# Altium schematic sheet SCH2_Switching.SchDoc
size B; Organization: CWRUbotix; Address1: 10900 Euclid Avenue; Address2: Cleveland, OH 44106; Address3: USA
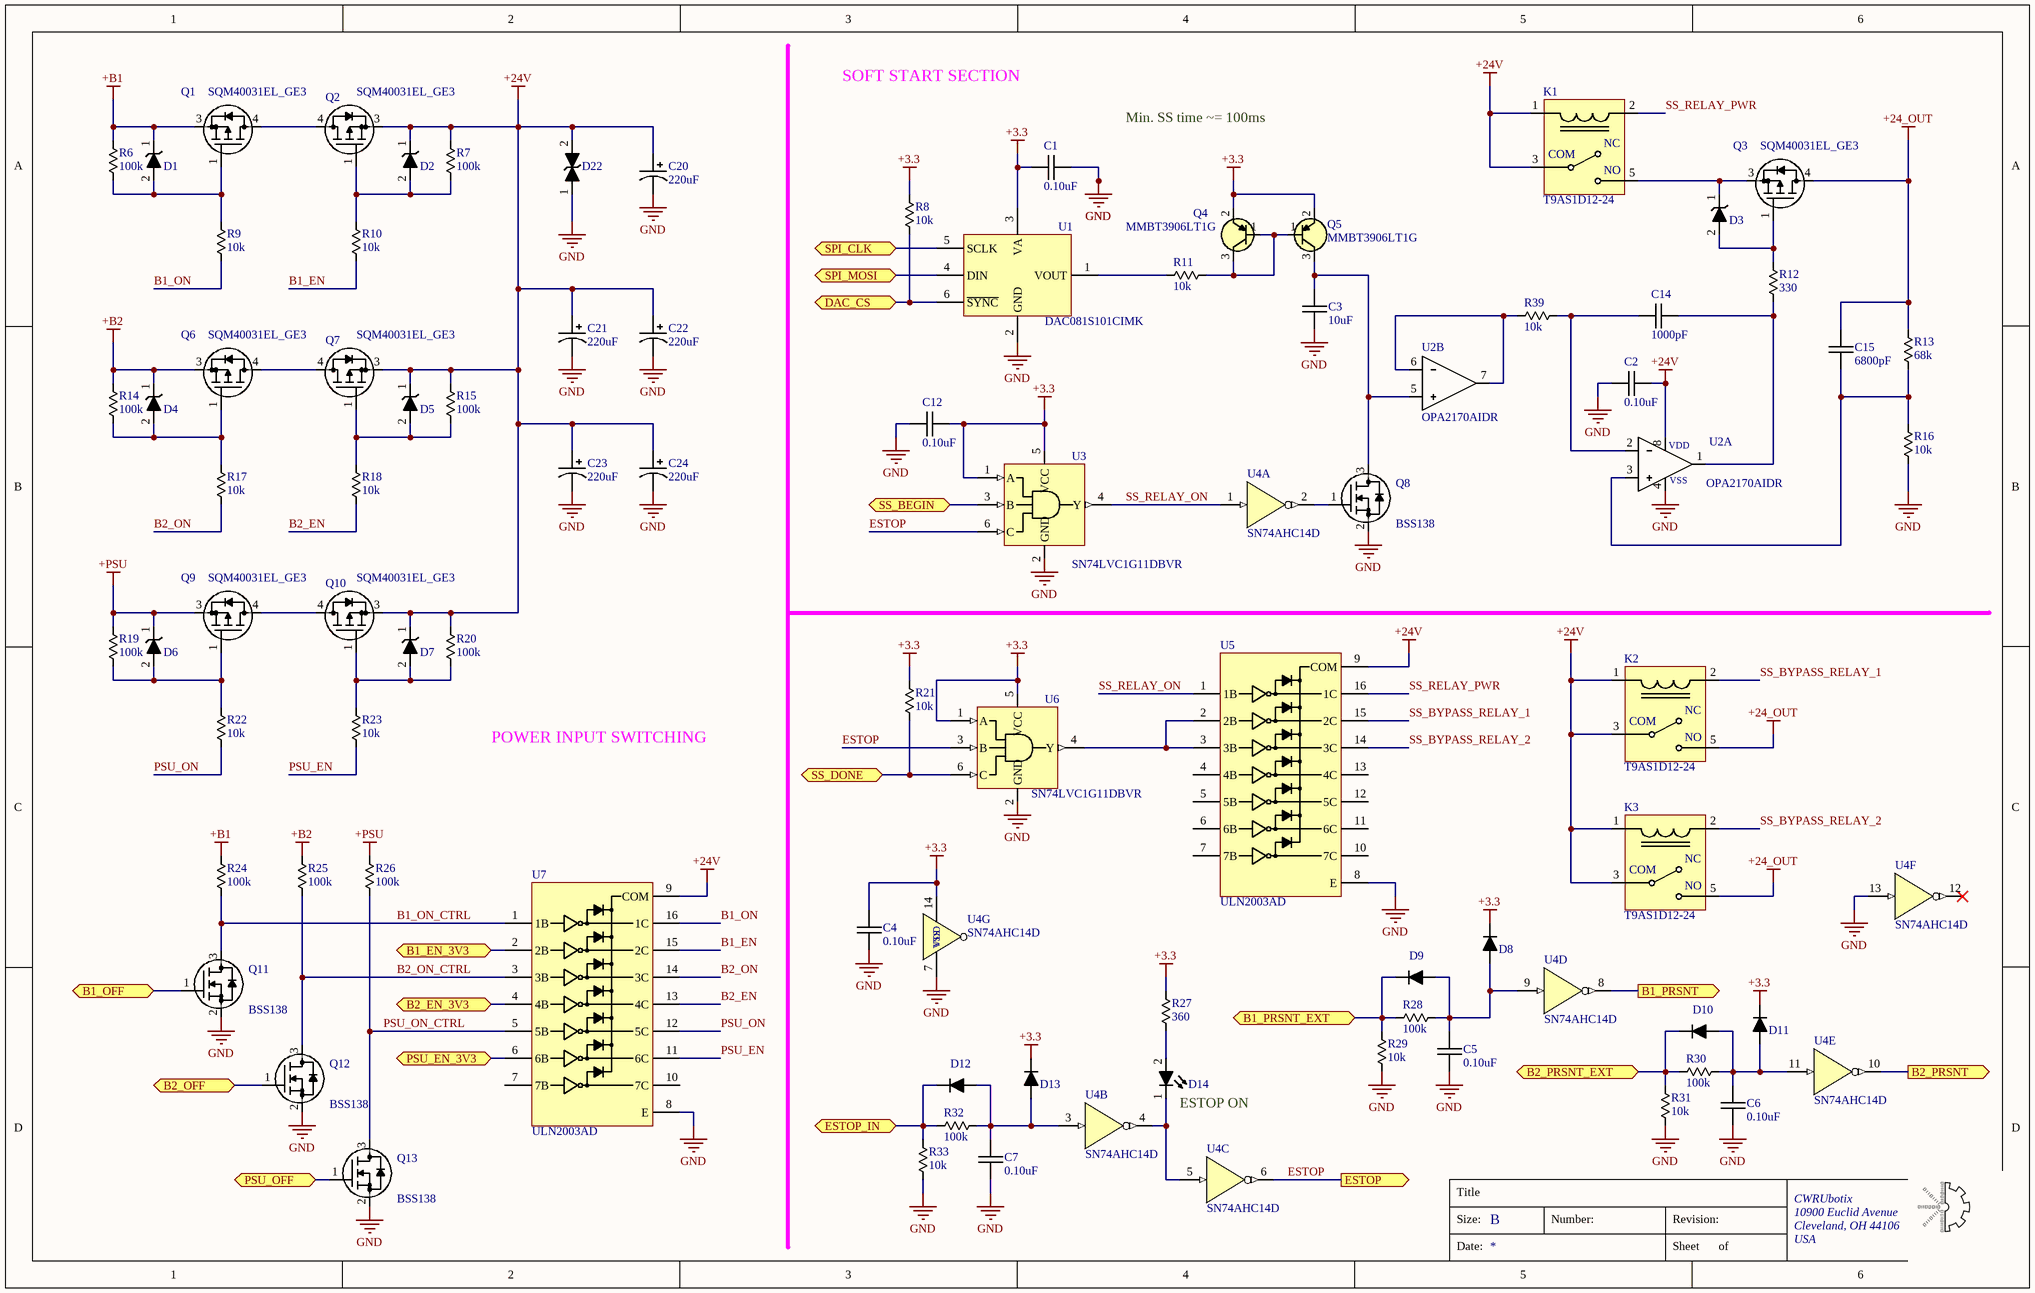
[diagram p0: SCH2_Switching.SchDoc]

## Parts
C1  0.10uF  [chip_0805]
C2  0.10uF  [chip_0805]
C3  10uF  [chip_1206]
C4  0.10uF  [chip_0805]
C5  0.10uF  [chip_0805]
C6  0.10uF  [chip_0805]
C7  0.10uF  [chip_0805]
C12  0.10uF  [chip_0805]
C14  1000pF  [chip_0805]
C15  6800pF  [chip_0805]
C20  220uF  [CP_RADIAL_D10.0_P5.0_H20.0]
C21  220uF  [CP_RADIAL_D10.0_P5.0_H20.0]
C22  220uF  [CP_RADIAL_D10.0_P5.0_H20.0]
C23  220uF  [CP_RADIAL_D10.0_P5.0_H20.0]
C24  220uF  [CP_RADIAL_D10.0_P5.0_H20.0]
D1  diode_1  [sod123_0]  (value not drawn)
D2  diode_1  [sod123_0]  (value not drawn)
D3  diode_1  [sod123_0]  (value not drawn)
D4  diode_1  [sod123_0]  (value not drawn)
D5  diode_1  [sod123_0]  (value not drawn)
D6  diode_1  [sod123_0]  (value not drawn)
D7  diode_1  [sod123_0]  (value not drawn)
D8  diode_0  [sod123_0]  (value not drawn)
D9  diode_0  [sod123_0]  (value not drawn)
D10  diode_0  [sod123_0]  (value not drawn)
D11  diode_0  [sod123_0]  (value not drawn)
D12  diode_0  [sod123_0]  (value not drawn)
D13  diode_0  [sod123_0]  (value not drawn)
D14  diode_4  [chip_0603_LED]  (value not drawn)
D22  diode_5  [do-214ab]  (value not drawn)
K1  T9AS1D12-24  [TE_CONN_T9AS]
K2  T9AS1D12-24  [TE_CONN_T9AS]
K3  T9AS1D12-24  [TE_CONN_T9AS]
Q1  SQM40031EL_GE3  [D2PAK-3_1]
Q2  SQM40031EL_GE3  [D2PAK-3_1]
Q3  SQM40031EL_GE3  [D2PAK-3_1]
Q4  MMBT3906LT1G  [SOT-23-3_1]
Q5  MMBT3906LT1G  [SOT-23-3_1]
Q6  SQM40031EL_GE3  [D2PAK-3_1]
Q7  SQM40031EL_GE3  [D2PAK-3_1]
Q8  BSS138  [sot-23-3]
Q9  SQM40031EL_GE3  [D2PAK-3_1]
Q10  SQM40031EL_GE3  [D2PAK-3_1]
Q11  BSS138  [sot-23-3]
Q12  BSS138  [sot-23-3]
Q13  BSS138  [sot-23-3]
R6  100k  [chip_0805]
R7  100k  [chip_0805]
R8  10k  [chip_0805]
R9  10k  [chip_0805]
R10  10k  [chip_0805]
R11  10k  [chip_0805]
R12  330  [chip_0805]
R13  68k  [chip_0805]
R14  100k  [chip_0805]
R15  100k  [chip_0805]
R16  10k  [chip_0805]
R17  10k  [chip_0805]
R18  10k  [chip_0805]
R19  100k  [chip_0805]
R20  100k  [chip_0805]
R21  10k  [chip_0805]
R22  10k  [chip_0805]
R23  10k  [chip_0805]
R24  100k  [chip_0805]
R25  100k  [chip_0805]
R26  100k  [chip_0805]
R27  360  [chip_0805]
R28  100k  [chip_0805]
R29  10k  [chip_0805]
R30  100k  [chip_0805]
R31  10k  [chip_0805]
R32  100k  [chip_0805]
R33  10k  [chip_0805]
R39  10k  [chip_0805]
U1  DAC081S101CIMK  [TSOT-23-6]
U2  OPA2170AIDR  [SO-8_1]  (parts A,B of 2)
U3  SN74LVC1G11DBVR  [sot-23-6]
U4  SN74AHC14D  [SO-14]  (parts A,B,C,D,E,F,G of 7)
U5  ULN2003AD  [SO-16_1]
U6  SN74LVC1G11DBVR  [sot-23-6]
U7  ULN2003AD  [SO-16_1]

## Ports
B1_EN_3V3 (bidir), B1_OFF (bidir), B1_PRSNT (out), B1_PRSNT_EXT (bidir), B2_EN_3V3 (bidir), B2_OFF (bidir), B2_PRSNT (out), B2_PRSNT_EXT (bidir), DAC_CS (bidir), ESTOP (out), ESTOP_IN (bidir), PSU_EN_3V3 (bidir), PSU_OFF (bidir), SPI_CLK (bidir), SPI_MOSI (bidir), SS_BEGIN (bidir), SS_DONE (bidir)

## Nets
+3.3: C1.2 C4.2 C12.2 D8.1 D11.1 D13.1 Q4.2(E) Q5.2(E) R8.2 R21.2 R27.1 U1.3(VA) U3.1(A) U3.5(VCC) U4.14(VDD) U6.1(A) U6.5(VCC)
+24_OUT: C15.1 K2.5(NO) K3.5(NO) Q3.4(D) R13.1
+24V: C2.2 C20.1 C21.1 C22.1 C23.1 C24.1 D2.1 D5.1 D7.1 D22.2 K1.1 K1.3(COM) K2.1 K2.3(COM) K3.1 K3.3(COM) Q2.3(S) Q7.3(S) Q10.3(S) R7.1 R15.1 R20.1 U2.8 U5.9(COM) U7.9(COM)
+B1: D1.1 Q1.3(S) R6.1 R24.1
+B2: D4.1 Q6.3(S) R14.1 R25.1
+PSU: D6.1 Q9.3(S) R19.1 R26.1
GND: C1.1 C2.1 C3.2 C4.1 C5.1 C6.1 C7.1 C12.1 C20.2 C21.2 C22.2 C23.2 C24.2 D22.1 Q8.2(S) Q11.2(S) Q12.2(S) Q13.2(S) R16.2 R29.1 R31.1 R33.1 U1.2(GND) U2.4 U3.2(GND) U4.7(VSS) U4.13(F) U5.8(E) U6.2(GND) U7.8(E)
B1_EN: R10.2 U7.15(2C)
B1_EN_3V3: U7.2(2B) ; port B1_EN_3V3
B1_OFF: Q11.1(G) ; port B1_OFF
B1_ON: R9.2 U7.16(1C)
B1_ON_CTRL: Q11.3(D) R24.2 U7.1(1B)
B1_PRSNT: U4.8(J) ; port B1_PRSNT
B1_PRSNT_EXT: D9.1 R28.1 R29.2 ; port B1_PRSNT_EXT
B2_EN: R18.2 U7.13(4C)
B2_EN_3V3: U7.4(4B) ; port B2_EN_3V3
B2_OFF: Q12.1(G) ; port B2_OFF
B2_ON: R17.2 U7.14(3C)
B2_ON_CTRL: Q12.3(D) R25.2 U7.3(3B)
B2_PRSNT: U4.10(K) ; port B2_PRSNT
B2_PRSNT_EXT: D10.1 R30.1 R31.2 ; port B2_PRSNT_EXT
DAC_CS: R8.1 U1.6(~{SYNC}) ; port DAC_CS
ESTOP: U3.6(C) U4.6(~{C}) U6.3(B) ; port ESTOP
ESTOP_IN: D12.1 R32.1 R33.2 ; port ESTOP_IN
PSU_EN: R23.2 U7.11(6C)
PSU_EN_3V3: U7.6(6B) ; port PSU_EN_3V3
PSU_OFF: Q13.1(G) ; port PSU_OFF
PSU_ON: R22.2 U7.12(5C)
PSU_ON_CTRL: Q13.3(D) R26.2 U7.5(5B)
SPI_CLK: U1.5(SCLK) ; port SPI_CLK
SPI_MOSI: U1.4(DIN) ; port SPI_MOSI
SS_BEGIN: U3.3(B) ; port SS_BEGIN
SS_BYPASS_RELAY_1: K2.2 U5.15(2C)
SS_BYPASS_RELAY_2: K3.2 U5.14(3C)
SS_DONE: R21.1 U6.6(C) ; port SS_DONE
SS_RELAY_ON: U3.4(Y) U4.1(A) U5.1(1B)
SS_RELAY_PWR: K1.2 U5.16(1C)
NetC3_1: C3.1 Q5.3(C) Q8.3(D) U2.5
NetC5_2: C5.2 D8.2 D9.2 R28.2 U4.9(D)
NetC6_2: C6.2 D10.2 D11.2 R30.2 U4.11(E)
NetC7_2: C7.2 D12.2 D13.2 R32.2 U4.3(B)
NetC14_1: C14.1 R39.2 U2.2
NetC14_2: C14.2 R12.1 U2.1
NetC15_2: C15.2 R13.2 R16.1 U2.3
NetD1_2: D1.2 Q1.1(G) R6.2 R9.1
NetD2_2: D2.2 Q2.1(G) R7.2 R10.1
NetD3_1: D3.1 K1.5(NO) Q3.3(S)
NetD3_2: D3.2 Q3.1(G) R12.2
NetD4_2: D4.2 Q6.1(G) R14.2 R17.1
NetD5_2: D5.2 Q7.1(G) R15.2 R18.1
NetD6_2: D6.2 Q9.1(G) R19.2 R22.1
NetD7_2: D7.2 Q10.1(G) R20.2 R23.1
NetD14_1: D14.1 U4.4(~{B}) U4.5(C)
NetD14_2: D14.2 R27.2
NetQ1_4: Q1.4(D) Q2.4(D)
NetQ4_1: Q4.1(B) Q4.3(C) Q5.1(B) R11.2
NetQ6_4: Q6.4(D) Q7.4(D)
NetQ8_1: Q8.1(G) U4.2(~{A})
NetQ9_4: Q9.4(D) Q10.4(D)
NetR11_1: R11.1 U1.1(VOUT)
NetR39_1: R39.1 U2.6 U2.7
NetU5_2: U5.2(2B) U5.3(3B) U6.4(Y)

Not connected (* = marked no-connect by the designer): U4 12(L)*; U5 4(4B) 5(5B) 6(6B) 7(7B) 10(7C) 11(6C) 12(5C) 13(4C); U7 7(7B) 10(7C)

## Notes on the sheet
- SOFT START SECTION
- Min. SS time ~= 100ms
- POWER INPUT SWITCHING
- (near D14) ESTOP ON
- Title
- Size:
- B
- Number:
- Revision:
- Date:
- Sheet
- of
- (in symbol ANLG-00068, part A) VDD; VSS
- (in symbol MISC-00050) NC

## Library data of the parts
C1 C2 C4-C7 = CAP-00071: CAP, 0.10uF, 10%, 25V, X7R, 0805; Manufacturer: Murata; Manufacturer PN: GRM21BR71E104KA01L; Part Number: CAP-00071; Capacitance: 0.10uF; Tolerance: 10%; Voltage Rating: 25V; Type: X7R
C3 = CAP-00539: CAP, 10uF, ±10%, 25V, X7R, 1206; Manufacturer: Samsung; Manufacturer PN: CL31B106KAHNNNE; Part Number: CAP-00539; Capacitance: 10uF; Tolerance: ±10%; Voltage Rating: 25V; Type: X7R
C12 = CAP-00069: CAP, 0.10uF, 10%, 16V, X7R, 0805; Manufacturer: Murata; Manufacturer PN: GRM219R71C104KA01D; Part Number: CAP-00069; Capacitance: 0.10uF; Tolerance: 10%; Voltage Rating: 16V; Type: X7R
C14 = CAP-00009: CAP, 1000pF, 10%, 50V, X7R, 0805; Manufacturer: Murata; Manufacturer PN: GRM216R71H102KA01D; Part Number: CAP-00009; Capacitance: 1000pF; Tolerance: 10%; Voltage Rating: 50V; Type: X7R
C15 = CAP-00035: CAP, 6800pF, 10%, 50V, X7R, 0805; Manufacturer: Murata; Manufacturer PN: GRM216R71H682KA01D; Part Number: CAP-00035; Capacitance: 6800pF; Tolerance: 10%; Voltage Rating: 50V; Type: X7R
C20-C24 = CAP-00591: CAP, 220uF, ±20%, 63V, Al, 5000hrs @ 105°C; Manufacturer: Nichicon; Manufacturer PN: UPW1J221MPD; Part Number: CAP-00591; Capacitance: 220uF; Tolerance: ±20%; Voltage Rating: 63V; Type: Al; Cost: $0.70; Distributor Link: https://www.digikey.com/en/products/detail/nichicon/UPW1J221MPD/589683
D1-D7 = DIO-00072: Dio, Zener, 12V 5% 500mW SOD-123; Manufacturer: ON Semi; Manufacturer PN: MMSZ5242BT1G; Forward Voltage: 0.9V; Current Rating: 40mA; Part Number: DIO-00072; Reverse Breakdown Voltage: 12V; Tolerance: 5%; Power Rating: 500mW; Type: Zener; Cost: 0.21
D8-D13 = DIO-00060: Dio, Silicon, 200mA, 1V, 100V, SOD-123; Manufacturer: ON Semi; Manufacturer PN: SMMSD4148T3G; Forward Voltage: 1.0V; Part Number: DIO-00060; Reverse Breakdown Voltage: 100V; Current Rating: 200mA; Type: Silicon; Cost: 0.38
D14 = DIO-00049: LED, Blue, 0603, Low current, HELI2 Series; Manufacturer: Kingbright; Manufacturer PN: APT1608LVBC/D; Forward Voltage: 2.65V; Reverse Breakdown Voltage: 5V; Power Rating: 120mW; Current Rating: 30mA; Part Number: DIO-00049; Type: LED; Cost: 0.58
D22 = DIO-00090: TVS, 28V, 45.5V@66A, 3kW 66A Peak, Bidirectional, DO-214AC; Manufacturer: ST; Manufacturer PN: SMC30J28CA; Reverse Breakdown Voltage: 31.1V; Power Rating: 3000W; Part Number: DIO-00090; Current Rating: 66A; Type: TVS; Cost: 1.2; Distributor Link: https://www.digikey.com/en/products/detail/stmicroelectronics/SMC30J28CA/2826980
K1-K3 = MISC-00050: Relay, 24V Coil, 30A, SPST, 1 Form A; Manufacturer: TE Connectivity; Part Number: MISC-00050; Manufacturer PN: T9AS1D12-24; Cost: 5.04
Q1-Q3 Q6 Q7 Q9 Q10 = XSTR-00046: XSTR, MOSFET P-Channel, 40V 120A 3mOhm Rds On, D2PAK; Manufacturer: Vishay Siliconix; Max Power: 375W; Type: PMOS; Vgs/Vce: 2.5V; Part Number: XSTR-00046; Max Voltage: 40V; Max Current: 120A; Manufacturer PN: SQM40031EL_GE3; Cost: 2.81
Q4 Q5 = XSTR-00038: XSTR, PNP, 200mA, 40V, Vce 0.4V, SOT-23-3; Manufacturer: ON Semi; Max Power: 300mW; Part Number: XSTR-00038; Max Voltage: 40V; Max Current: 200mA; Type: PNP; Vgs/Vce: 0.4V; Manufacturer PN: MMBT3906LT1G; Cost: 0.12
Q8 Q11-Q13 = XSTR-00017: XSTR NMOS, 220mA, 50V, Vgs 1.3V, SOT-23-3; Manufacturer: ON Semi; Max Power: 360mW; Type: NFET; Part Number: XSTR-00017; Max Voltage: 50V; Max Current: 220mA; Vgs/Vce: 1.3V; Manufacturer PN: BSS138; Cost: 0.31
R6 R7 R14 R15 R19 R20 R24-R26 R28 R30 R32 = RES-00302: RES SMD 100K OHM 1% 1/8W 0805; Manufacturer: Rohm Semiconductor; Manufacturer PN: KTR10EZPF1003; Power Rating: 0.125W; Part Number: RES-00302; Resistance: 100k; Tolerance: 1%
R8-R11 R16-R18 R21-R23 R29 R31 R33 R39 = RES-00307: RES SMD 10K OHM 1% 1/8W 0805; Manufacturer: Rohm Semiconductor; Manufacturer PN: KTR10EZPF1002; Power Rating: 0.125W; Part Number: RES-00307; Resistance: 10k; Tolerance: 1%
R12 = RES-00222: RES SMD 330 OHM 1% 1/8W 0805; Manufacturer: Rohm Semiconductor; Manufacturer PN: KTR10EZPF3300; Power Rating: 0.125W; Part Number: RES-00222; Resistance: 330; Tolerance: 1%
R13 = RES-00724: RES SMD 68K OHM 1% 1/8W 0805 100ppm; Manufacturer: Yageo; Manufacturer PN: RC0805FR-0768KL; Part Number: RES-00724; Resistance: 68k; Tolerance: 1%; Power Rating: 1/8W; Cost: 0.1
R27 = RES-00226: RES SMD 360 OHM 1% 1/8W 0805; Manufacturer: Rohm Semiconductor; Manufacturer PN: KTR10EZPF3600; Power Rating: 0.125W; Part Number: RES-00226; Resistance: 360; Tolerance: 1%
U1 = ANLG-00080: IC, DAC, 8-bit, Rail-Rail Output, SPI, 2.7~5.5V; Manufacturer: TI; Part Number: ANLG-00080; Manufacturer PN: DAC081S101CIMK; Cost: 1.45
U2 = ANLG-00068: Op Amp, Dual, Rail-Rail, 2.7~36V, 2.1-MHz, SOIC-8; Manufacturer: TI; Part Number: ANLG-00068; Manufacturer PN: OPA2170AIDR; Cost: 1.84
U3 U6 = LOGIC-00042: IC, AND Gate, Single 3-Input, 1.65-5.5V, SOT-23-6; Manufacturer: TI; Part Number: LOGIC-00042; Manufacturer PN: SN74LVC1G11DBVR; Cost: $0.37
U4 = LOGIC-00014: IC, Inverter, Hex, Schmitt Triggered Inputs, SOIC-14, SN74ACH14D; Manufacturer: TI; Part Number: LOGIC-00014; Manufacturer PN: SN74AHC14D; Cost: $0.41
U5 U7 = ANLG-00079: IC, 7 NPN Darlington Array, 50V 500mA; Manufacturer: TI; Part Number: ANLG-00079; Manufacturer PN: ULN2003AD; Cost: 0.49